# Altium schematic sheet Sheet1.SchDoc
size A4; SheetNumber: 1; SheetTotal: 1
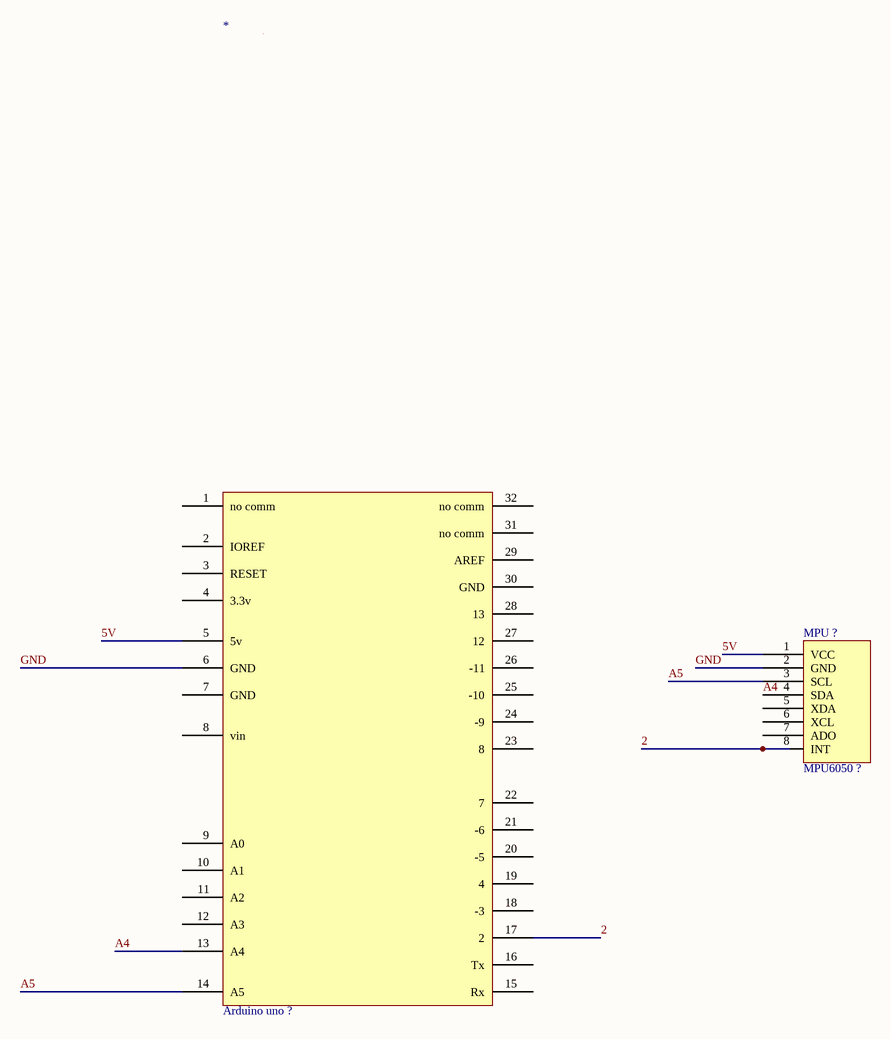
[diagram p0: Sheet1.SchDoc]

## Parts
*  Arduino uno ?  [ARD LIB]
MPU_?  MPU6050 ?  [MPU pcb - duplicate]

## Nets
2: *.17(2) MPU_?.8(INT)
5V: *.5(5v) MPU_?.1(VCC)
A4: *.13(A4) MPU_?.4(SDA)
A5: *.14(A5) MPU_?.3(SCL)
GND: *.6(GND) MPU_?.2(GND)

Not connected (* = marked no-connect by the designer): * 1(no_comm) 2(IOREF) 3(RESET) 4(3.3v) 7(GND) 8(vin) 9(A0) 10(A1) 11(A2) 12(A3) 15(Rx) 16(Tx) 18(-3) 19(4) 20(-5) 21(-6) 22(7) 23(8) 24(-9) 25(-10) 26(-11) 27(12) 28(13) 29(AREF) 30(GND) 31(no_comm) 32(no_comm); MPU_? 5(XDA) 6(XCL) 7(ADO)

## Library data of the parts
* = Arduino uno ?: Parameter 1: ARDUINO
MPU_? = MPU6050 ?: Parameter 1: MPU6050